# EAGLE schematic A2235-H (EAGLE 7.2.0)
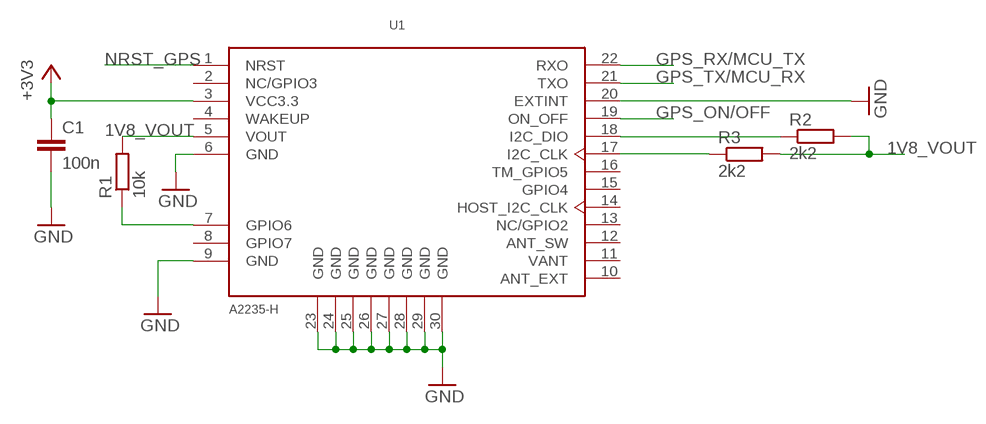
[diagram p0: schematic, sheet 1]

## Parts
C1  100n  C-EUC0805  [C0805]
R1  10k  R-EU_R0805  [R0805]
R2  2k2  R-EU_R0805  [R0805]
R3  2k2  R-EU_R0805  [R0805]
U1  A2235-H  [XCVR_A2235-H]

## Nets
1V8_VOUT: R1.2 R2.2 R3.2 U1.5(VOUT)
+3V3: C1.1 U1.3(VCC3.3)
GND: C1.2 U1.6(GND) U1.9(GND) U1.20(EXTINT) U1.23(GND) U1.24(GND) U1.25(GND) U1.26(GND) U1.27(GND) U1.28(GND) U1.29(GND) U1.30(GND)
GPS_ON/OFF: U1.19(ON_OFF)
GPS_RX/MCU_TX: U1.22(RXO)
GPS_TX/MCU_RX: U1.21(TXO)
N$1: R1.1 U1.7(GPIO6)
N$3: R2.1 U1.18(I2C_DIO)
N$4: R3.1 U1.17(I2C_CLK)
NRST_GPS: U1.1(NRST)
Unconnected: U1.2(NC/GPIO3) U1.4(WAKEUP) U1.8(GPIO7) U1.10(ANT_EXT) U1.12(ANT_SW) U1.13(NC/GPIO2) U1.14(HOST_I2C_CLK) U1.15(GPIO4) U1.16(TM_GPIO5)

## Power pins joined to a net without a drawn wire
VANT: U1.11(VANT)

## Library data of the parts
C1 = rcl:C-EU: CAPACITOR, European symbol
R1-R3 = rcl:R-EU_: RESISTOR, European symbol
U1 = A2235-H:A2235-H: Gps Module, Mini Outline w/ Ant; AVAILABILITY: Good; DESCRIPTION: Gps Module, Mini Outline w/ Ant; MF: Maestro Wireless; MP: A2235H; PACKAGE: None; PRICE: 15.70 USD